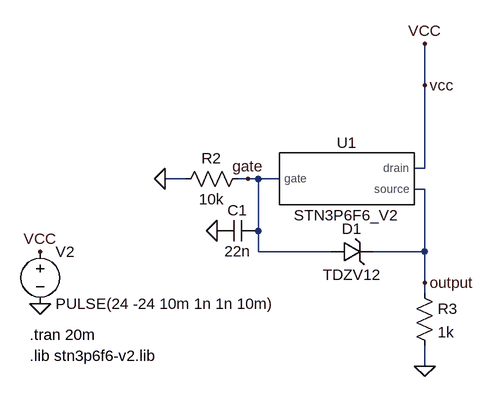
[diagram p0: schematic reversed_polarity_protection.asc]
reversed_polarity_protection.asc, the LTspice schematic file:
Version 4
SHEET 1 880 680
WIRE 416 64 416 0
WIRE 416 192 416 64
WIRE 416 192 400 192
WIRE 48 208 16 208
WIRE 144 208 128 208
WIRE 160 208 144 208
WIRE 192 208 160 208
WIRE 416 224 400 224
WIRE 160 288 160 208
WIRE 160 320 160 288
WIRE 272 320 160 320
WIRE 416 320 416 224
WIRE 416 320 336 320
WIRE 416 368 416 320
WIRE 416 384 416 368
WIRE 416 496 416 464
FLAG 416 496 0
FLAG -176 400 0
FLAG -176 320 VCC
FLAG 416 0 VCC
FLAG 16 208 0
FLAG 96 288 0
FLAG 416 64 vcc
FLAG 416 368 output
FLAG 144 208 gate
SYMBOL voltage -176 304 R0
WINDOW 123 0 0 Left 0
WINDOW 39 0 0 Left 0
SYMATTR InstName V2
SYMATTR Value PULSE(24 -24 10m 1n 1n 10m)
SYMBOL STN3P6F6_V2 288 208 R0
SYMATTR InstName U1
SYMBOL res 144 192 R90
WINDOW 0 0 56 VBottom 2
WINDOW 3 32 56 VTop 2
SYMATTR InstName R2
SYMATTR Value 10k
SYMBOL zener 272 336 R270
WINDOW 0 36 32 VTop 2
WINDOW 3 -4 32 VBottom 2
SYMATTR InstName D1
SYMATTR Value TDZV12
SYMATTR Description Diode
SYMATTR Type diode
SYMBOL res 400 368 R0
SYMATTR InstName R3
SYMATTR Value 1k
SYMBOL cap 160 272 R90
WINDOW 0 0 32 VBottom 2
WINDOW 3 32 32 VTop 2
SYMATTR InstName C1
SYMATTR Value 22n
TEXT -192 480 Left 2 !.lib stn3p6f6-v2.lib
TEXT -192 448 Left 2 !.tran 20m

The netlist it stands for:
* reversed_polarity_protection.asc
V2 VCC 0 PULSE(24 -24 10m 1n 1n 10m)
XU1 VCC gate output STN3P6F6_V2  ; pins drain gate source
R2 gate 0 10k
D1 gate output TDZV12
R3 output 0 1k
C1 gate 0 22n
.model D D
.lib standard.dio
.lib stn3p6f6-v2.lib
.tran 20m
.lib C:\Users\Administrator\Desktop\Motorsport\PUTM_EV_DASHBOARD_TESTBOARD_2025\simulation\stn3p6f6-v2.lib
.backanno
.end